# Altium project Robot Myjący podłogi.PrjPcb
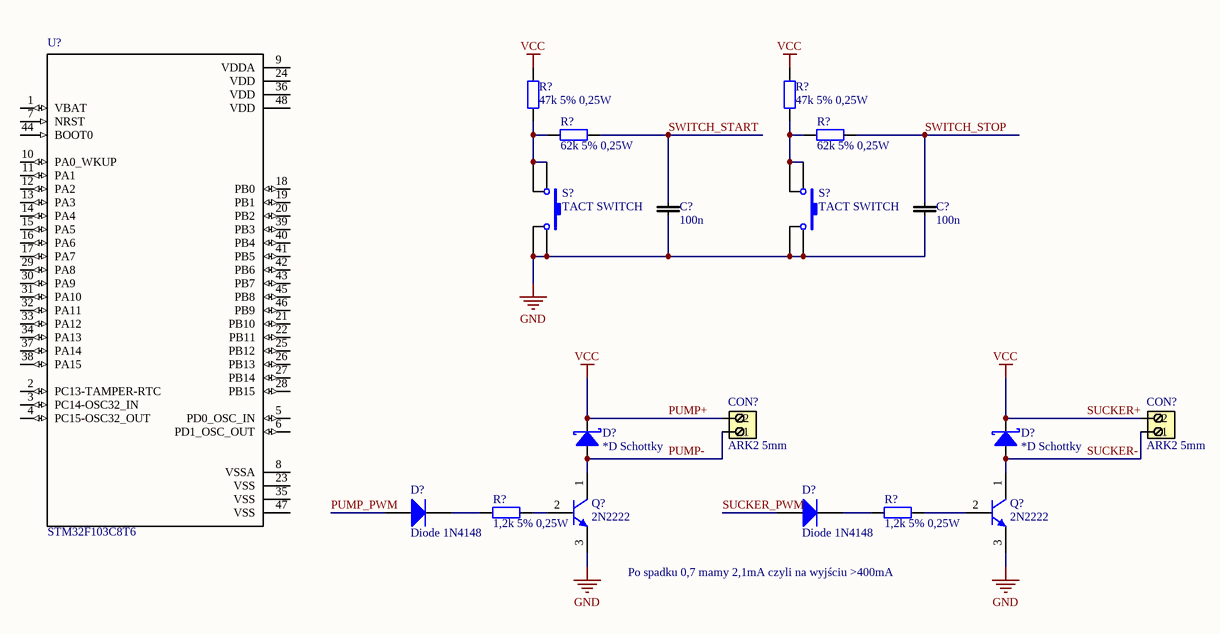
[diagram p0: Sheet1.SchDoc]
2 sheets, 106 parts. Net scope: global (net labels, ports and power ports of the same name join across sheets).
Board file: PCB1.PcbDoc
Sheets:
  Sheet1.SchDoc
  Sheet2.SchDoc

## Sheet Sheet1.SchDoc
size A4

### Parts
(Parts that share a designator on the sheet are numbered #1, #2 ... from top to bottom, then left to right.)
C?#1  100n  [C THT  FILM X2]
C?#2  100n  [C THT  FILM X2]
CON?#1  ARK2 5mm  [ARK5-2]
CON?#2  ARK2 5mm  [ARK5-2]
D?#1  *D Schottky  [SMA]
D?#2  *D Schottky  [SMA]
D?#3  Diode 1N4148  [DO-35]
D?#4  Diode 1N4148  [DO-35]
Q?#1  2N2222  [ONSC-TO-92-3-29-11]
Q?#2  2N2222  [ONSC-TO-92-3-29-11]
R?#1  47k 5% 0,25W  [RES-15mm_0.25W]
R?#2  47k 5% 0,25W  [RES-15mm_0.25W]
R?#3  62k 5% 0,25W  [RES-15mm_0.25W]
R?#4  62k 5% 0,25W  [RES-15mm_0.25W]
R?#5  1,2k 5% 0,25W  [RES-15mm_0.25W]
R?#6  1,2k 5% 0,25W  [RES-15mm_0.25W]
S?#1  TACT SWITCH  [DTS6]
S?#2  TACT SWITCH  [DTS6]
U?#1  STM32F103C8T6  [*QFP50P900X900X160-48N]

### Nets
GND: C?#1.1 C?#2.1 Q?#1.3(E) Q?#2.3(E) S?#1.3 S?#1.4 S?#2.3 S?#2.4
PUMP+: CON?#1.2 CON?#2.2 D?#1.2(K) D?#2.2(K) R?#1.2 R?#2.2  [also labelled SUCKER+, VCC]  [project net BUZZ+]
PUMP-: CON?#1.1 D?#1.1(A) Q?#1.1(C)
PUMP_PWM: D?#3.1(A)
SUCKER-: CON?#2.1 D?#2.1(A) Q?#2.1(C)
SUCKER_PWM: D?#4.1(A)
SWITCH_START: C?#1.2 R?#3.2
SWITCH_STOP: C?#2.2 R?#4.2
NetD?#3_2: D?#3.2(K) R?#5.1
NetD?#4_2: D?#4.2(K) R?#6.1
NetQ?#1_2: Q?#1.2(B) R?#5.2
NetQ?#2_2: Q?#2.2(B) R?#6.2
NetR?#1_1: R?#1.1 R?#3.1 S?#1.1 S?#1.2
NetR?#2_1: R?#2.1 R?#4.1 S?#2.1 S?#2.2

Not connected (* = marked no-connect by the designer): U?#1 1(VBAT) 2(PC13-TAMPER-RTC) 3(PC14-OSC32_IN) 4(PC15-OSC32_OUT) 5(PD0_OSC_IN) 6(PD1_OSC_OUT) 7(NRST) 8(VSSA) 9(VDDA) 10(PA0_WKUP) 11(PA1) 12(PA2) 13(PA3) 14(PA4) 15(PA5) 16(PA6) 17(PA7) 18(PB0) 19(PB1) 20(PB2) 21(PB10) 22(PB11) 23(VSS) 24(VDD) 25(PB12) 26(PB13) 27(PB14) 28(PB15) 29(PA8) 30(PA9) 31(PA10) 32(PA11) 33(PA12) 34(PA13) 35(VSS) 36(VDD) 37(PA14) 38(PA15) 39(PB3) 40(PB4) 41(PB5) 42(PB6) 43(PB7) 44(BOOT0) 45(PB8) 46(PB9) 47(VSS) 48(VDD)

### Notes on the sheet
- Po spadku 0,7 mamy 2,1mA czyli na wyjściu >400mA

### Library data of the parts
C?#1 C?#2 = *C THT: Film Capacitor; Publisher: Kamil Pawliczak; Value: 100n; HelpURL: C:\Altium\Biblioteki\elementy_bierne\doc\kondensator.txt
CON?#1 CON?#2 = ARK2 5mm: ARK2 CONNECTOR; Class: U; PN Piekarz: 00561; Preferred shop: Piekarz; PN Other: *; PN TME: EBBA-02-C-SS-BU; Publisher: NXT Labs; Type: CON
D?#1 D?#2 = *D Schottky: Schottky Diode; Publisher: Kamil Pawliczak
D?#3 D?#4 = Diode 1N4148: High Conductance Fast Diode; Published: 8-Jun-2000; LatestRevisionDate: 17-Jul-2002; LatestRevisionNote: Re-released for DXP Platform.; DatasheetVersion: 1997; PackageReference: DO-35; Publisher: Altium Limited; PackageDescription: Diode, Axial; Body 3.8 x 1.9 mm (LxDia. max), Lead Dia. 0.53 mm (max); Code_JEDEC: DO-204-AH; ComponentLink1Description: Manufacturer Link; ComponentLink1URL: http://www.fairchildsemi.com/; ComponentLink2Description: Datasheet; ComponentLink2URL: http://www.fairchildsemi.com/ds/1N%2F1N4148.pdf
Q?#1 Q?#2 = CMP-1048-01402-1: Amplifier Transistor, NPN Silicon, 3-Pin TO-92, Pb-Free, Bulk Box; PartNumber: P2N2222AG; Manufacturer: On Semiconductor; IC Continuous (A): 0.6; fT Min (MHz): 300; ComponentLink2Description: Datasheet; ComponentLink1Description: Manufacturer URL; ComponentLink2URL: http://www.onsemi.com/pub_link/Collateral/P2N2222A-D.PDF; ComponentLink3Description: Package Specification; RoHS: TRUE; ComponentLink1URL: http://www.onsemi.com/; Mounting Technology: Through Hole; PackageReference: TO-92-3-29-11_AM_SL; Polarity: NPN; Packing: Bulk Box; DatasheetVersion: Rev. 7; PackageDescription: 3-Pin Transistor Outline, Body 4.825 x 3.685 mm, Pitch 1.27 mm; PackageVersion: Rev. AM; ComponentLink3URL: http://www.onsemi.cn/pub_link/Collateral/2N6426-D.PDF
R?#1-R?#6 = 470 5% 0,25W H 15mm: Tht resistor; Value: 470; PN Piekarz: 03311; Preferred shop: P; Class: U; PD: 0,25W; Publisher: NXT Labs; Type: R; PN TME: CF1/4W-470R; PN Other: *; Tolerance: 5%
S?#1 S?#2 = TACT SWITCH: 6x6mm Switch; Publisher: Kamil Pawliczak; ComponentLink1Description: DTS6 - Dokumentacja; ComponentLink1URL: C:\Altium\Biblioteki\elementy_stykowe\doc\dts6.pdf
U?#1 = STM32F103C8T6: Mainstream Performance line, ARM Cortex-M3 MCU with 64 Kbytes Flash, 72 MHz CPU, motor control, USB and CAN; MF: STMicroelectronics; Price: None; MP: STM32F103C8T6; SnapEDA_Link: https://www.snapeda.com/parts/STM32F103C8T6/STMicroelectronics/view-part/?ref=snap; Package: LQFP-48 STMicroelectronics; Availability: Unavailable; Value: *

## Sheet Sheet2.SchDoc
size A2; Organization: Altium Limited; Address1: L3, 12a Rodborough Rd; Address2: Frenchs Forest; Address3: NSW; Address4: Australia 2086
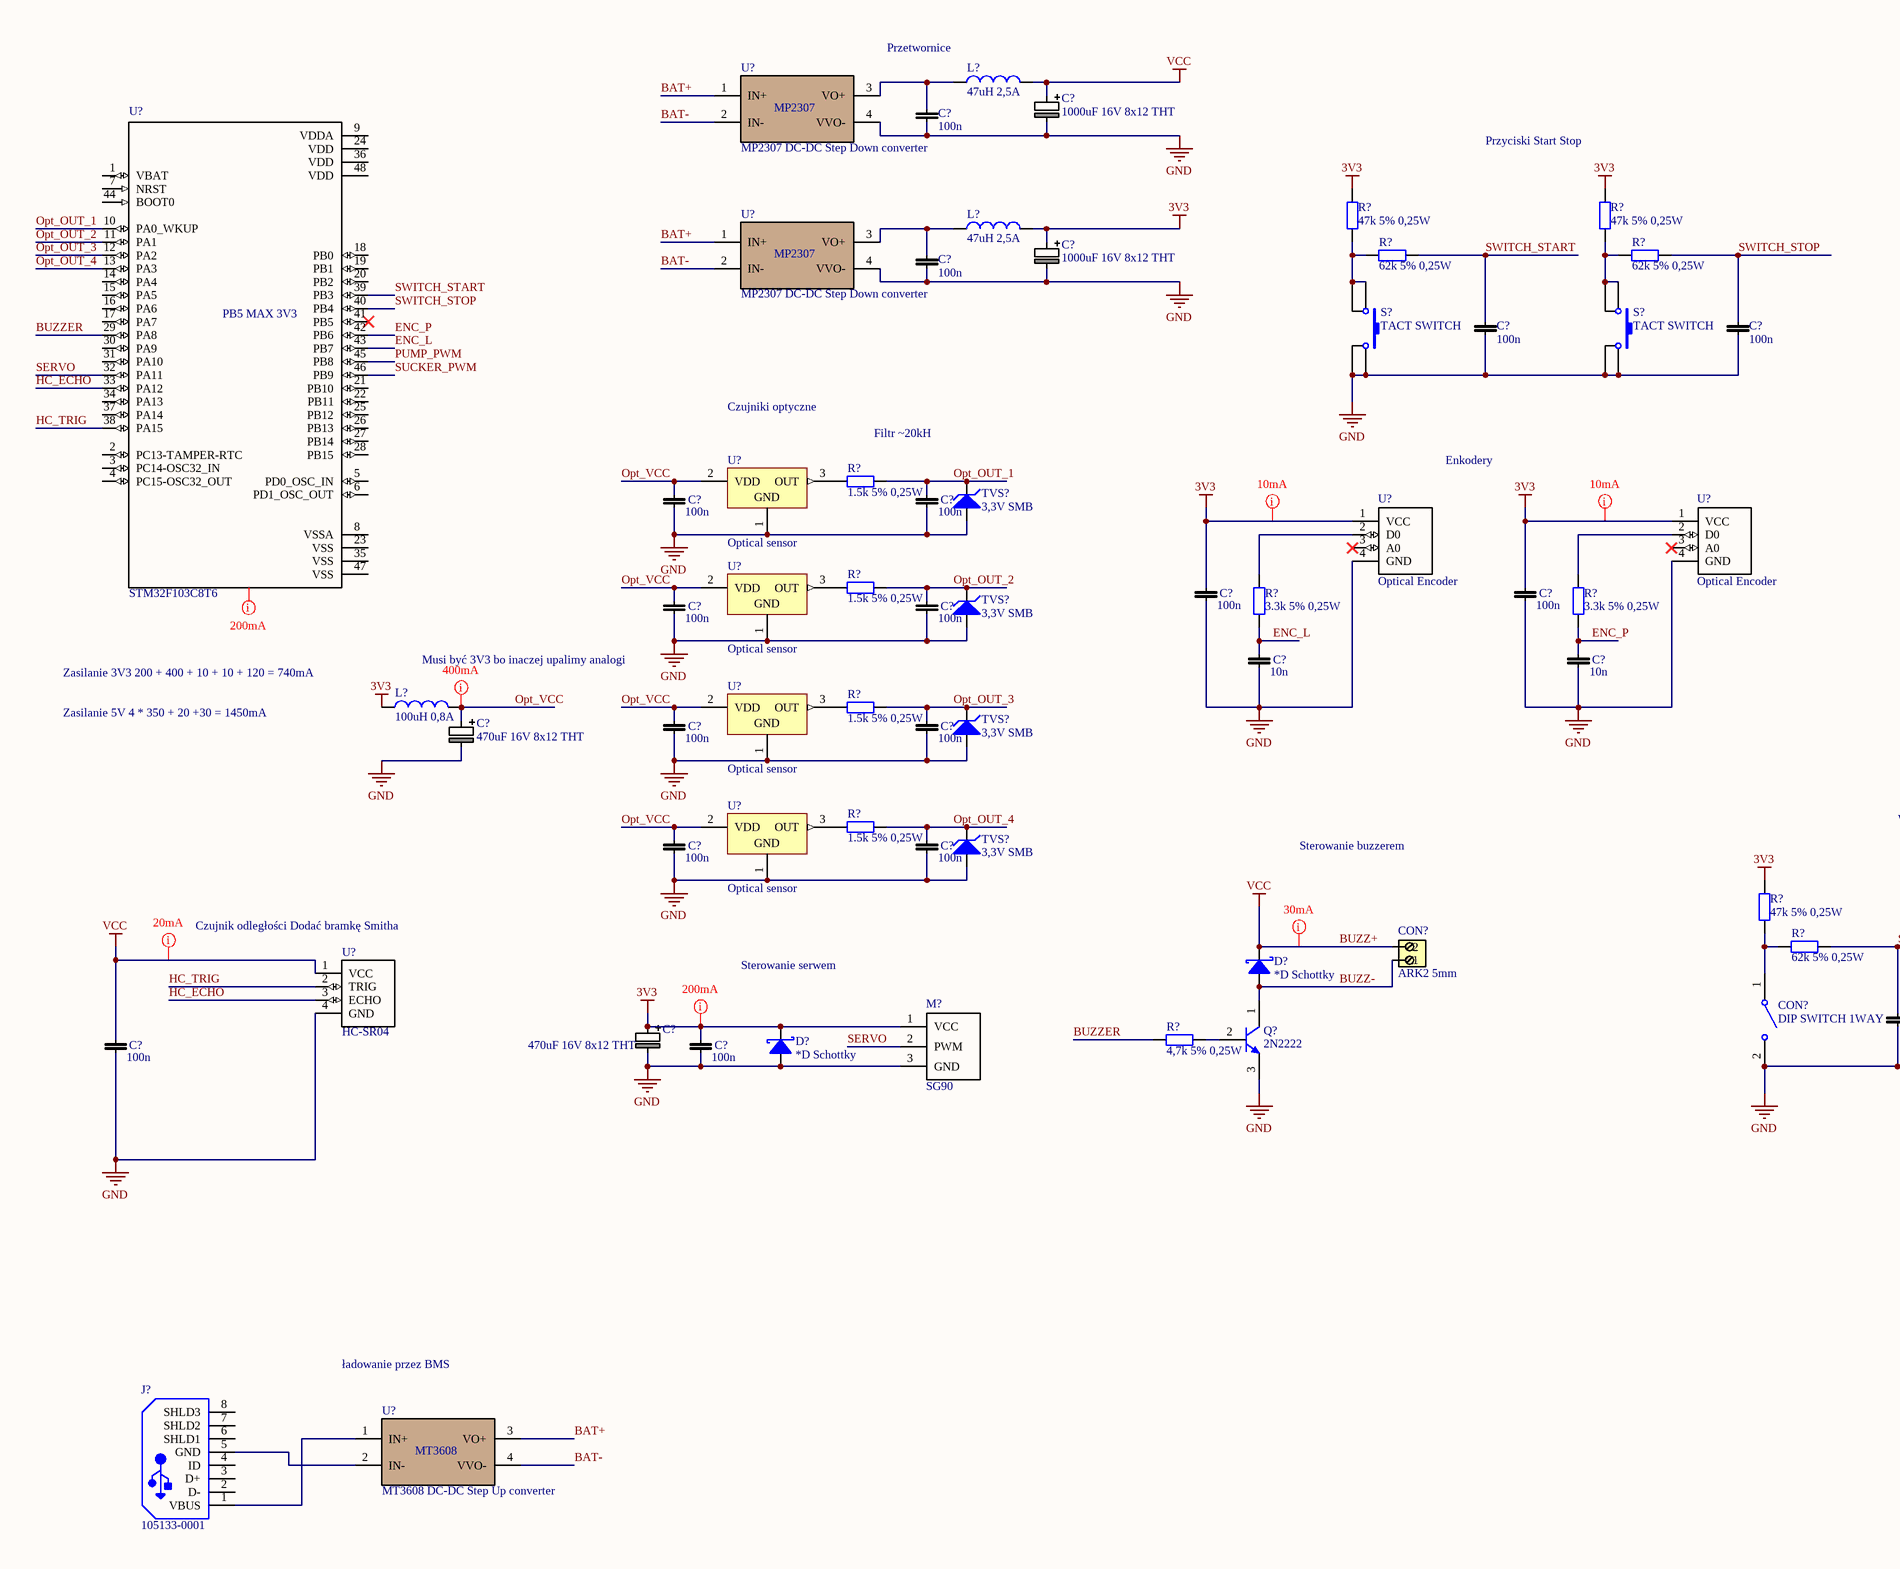
[diagram p1: Sheet2.SchDoc, left]
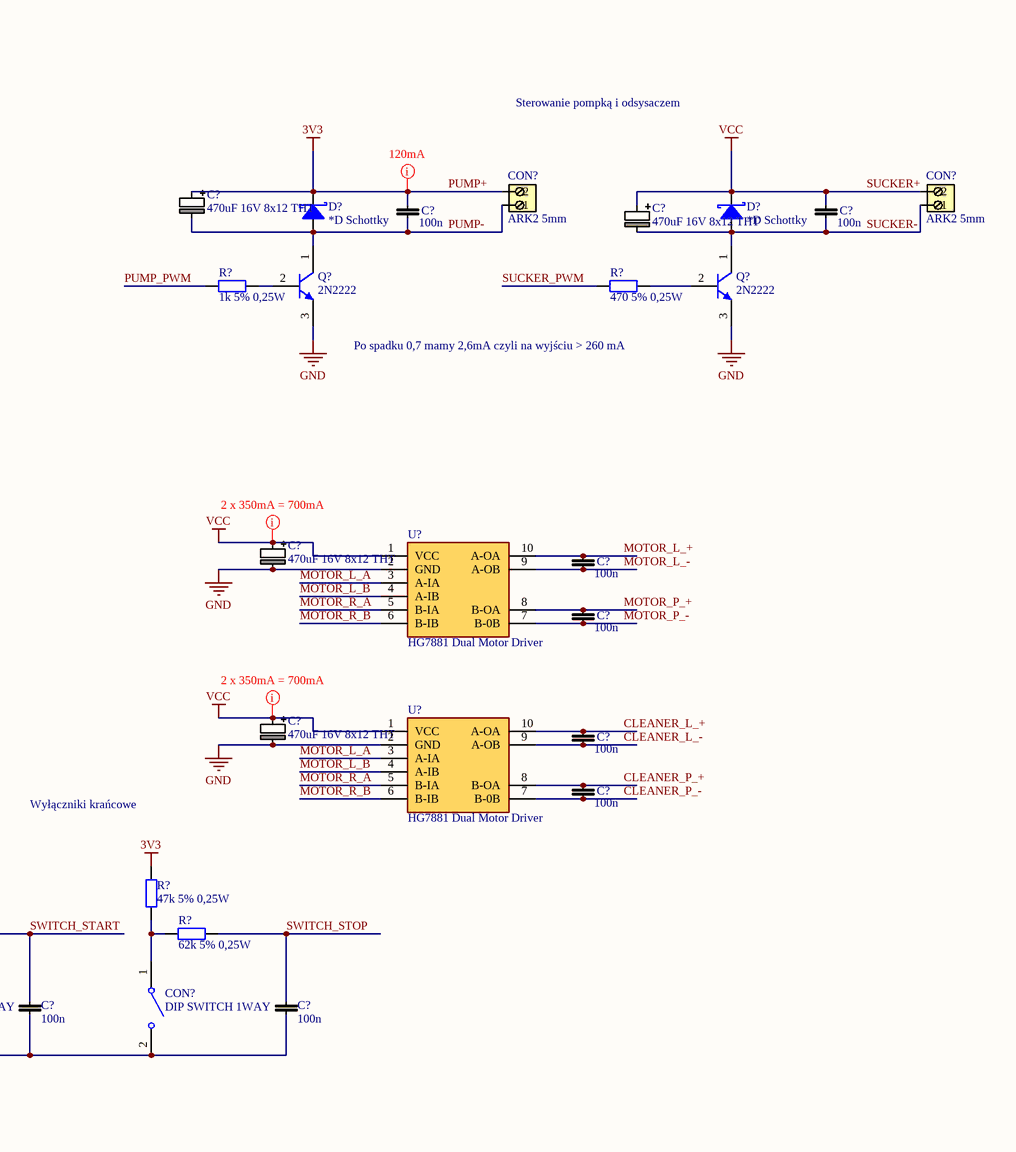
[diagram p2: Sheet2.SchDoc, right]

### Parts
(Parts that share a designator on the sheet are numbered #1, #2 ... from top to bottom, then left to right.)
C?#3  1000uF 16V 8x12 THT  [EL8x12]
C?#4  100n  [C THT  FILM X2]
C?#5  470uF 16V 8x12 THT  [EL8x12]
C?#6  100n  [C THT  FILM X2]
C?#7  470uF 16V 8x12 THT  [EL8x12]
C?#8  100n  [C THT  FILM X2]
C?#9  1000uF 16V 8x12 THT  [EL8x12]
C?#10  100n  [C THT  FILM X2]
C?#11  100n  [C THT  FILM X2]
C?#12  100n  [C THT  FILM X2]
C?#13  100n  [C THT  FILM X2]
C?#14  100n  [C THT  FILM X2]
C?#15  470uF 16V 8x12 THT  [EL8x12]
C?#16  100n  [C THT  FILM X2]
C?#17  100n  [C THT  FILM X2]
C?#18  100n  [C THT  FILM X2]
C?#19  100n  [C THT  FILM X2]
C?#20  100n  [C THT  FILM X2]
C?#21  100n  [C THT  FILM X2]
C?#22  10n  [C THT  FILM X2]
C?#23  10n  [C THT  FILM X2]
C?#24  470uF 16V 8x12 THT  [EL8x12]
C?#25  100n  [C THT  FILM X2]
C?#26  100n  [C THT  FILM X2]
C?#27  470uF 16V 8x12 THT  [EL8x12]
C?#28  100n  [C THT  FILM X2]
C?#29  100n  [C THT  FILM X2]
C?#30  100n  [C THT  FILM X2]
C?#31  100n  [C THT  FILM X2]
C?#32  100n  [C THT  FILM X2]
C?#33  100n  [C THT  FILM X2]
C?#34  470uF 16V 8x12 THT  [EL8x12]
C?#35  100n  [C THT  FILM X2]
C?#36  100n  [C THT  FILM X2]
CON?#3  ARK2 5mm  [ARK5-2]
CON?#4  ARK2 5mm  [ARK5-2]
CON?#5  ARK2 5mm  [ARK5-2]
CON?#6  DIP SWITCH 1WAY  [DIP_SWITCH_1P_L]
CON?#7  DIP SWITCH 1WAY  [DIP_SWITCH_1P_L]
D?#5  *D Schottky  [SMA]
D?#6  *D Schottky  [SMA]
D?#7  *D Schottky  [SMA]
D?#8  *D Schottky  [SMA]
J?  105133-0001  [MOLX-105133-0001_V]
L?#1  47uH 2,5A  [MSS1278 SERIES]
L?#2  47uH 2,5A  [MSS1278 SERIES]
L?#3  100uH 0,8A  [MSS1278 SERIES]
M?  SG90
Q?#3  2N2222  [ONSC-TO-92-3-29-11]
Q?#4  2N2222  [ONSC-TO-92-3-29-11]
Q?#5  2N2222  [ONSC-TO-92-3-29-11]
R?#7  47k 5% 0,25W  [RES-15mm_0.25W]
R?#8  47k 5% 0,25W  [RES-15mm_0.25W]
R?#9  62k 5% 0,25W  [RES-15mm_0.25W]
R?#10  62k 5% 0,25W  [RES-15mm_0.25W]
R?#11  1k 5% 0,25W  [RES-15mm_0.25W]
R?#12  470 5% 0,25W  [RES-15mm_0.25W]
R?#13  1.5k 5% 0,25W  [RES-15mm_0.25W]
R?#14  1.5k 5% 0,25W  [RES-15mm_0.25W]
R?#15  3.3k 5% 0,25W  [RES-15mm_0.25W]
R?#16  3.3k 5% 0,25W  [RES-15mm_0.25W]
R?#17  1.5k 5% 0,25W  [RES-15mm_0.25W]
R?#18  1.5k 5% 0,25W  [RES-15mm_0.25W]
R?#19  47k 5% 0,25W  [RES-15mm_0.25W]
R?#20  47k 5% 0,25W  [RES-15mm_0.25W]
R?#21  62k 5% 0,25W  [RES-15mm_0.25W]
R?#22  62k 5% 0,25W  [RES-15mm_0.25W]
R?#23  4,7k 5% 0,25W  [RES-15mm_0.25W]
S?#3  TACT SWITCH  [DTS6]
S?#4  TACT SWITCH  [DTS6]
TVS?#1  3,3V SMB  [SMB]
TVS?#2  3,3V SMB  [SMB]
TVS?#3  3,3V SMB  [SMB]
TVS?#4  3,3V SMB  [SMB]
U?#2  MP2307 DC-DC Step Down converter  [DC_DC_SINGLE]
U?#3  MP2307 DC-DC Step Down converter  [DC_DC_SINGLE]
U?#4  STM32F103C8T6  [*QFP50P900X900X160-48N]
U?#5  Optical sensor  [AMS-S-3-4600X2600_V]
U?#6  Optical Encoder
U?#7  Optical Encoder
U?#8  Optical sensor  [AMS-S-3-4600X2600_V]
U?#9  HG7881 Dual Motor Driver
U?#10  Optical sensor  [AMS-S-3-4600X2600_V]
U?#11  HG7881 Dual Motor Driver
U?#12  Optical sensor  [AMS-S-3-4600X2600_V]
U?#13  HC-SR04  [*XCVR_HC-SR04]
U?#14  MT3608 DC-DC Step Up converter  [DC_DC_SINGLE]

### Nets
BUZZ+: C?#3.2(+) C?#5.2(+) C?#6.2 C?#7.2(+) C?#8.2 C?#9.2(+) C?#15.2(+) C?#17.2 C?#18.2 C?#27.2(+) C?#34.2(+) C?#35.2 C?#36.2 CON?#3.2 CON?#4.2 CON?#5.2 D?#5.2(K) D?#6.2(K) D?#7.2(K) D?#8.2(K) L?#1.2 L?#2.2 L?#3.1 M?.1(VCC) R?#7.2 R?#8.2 R?#19.2 R?#20.2 U?#6.1(VCC) U?#7.1(VCC) U?#9.1(VCC) U?#11.1(VCC) U?#13.1(VCC)  [also labelled 3V3, PUMP+, SUCKER+, VCC]
GND: C?#3.1(-) C?#4.1 C?#9.1(-) C?#10.1 C?#11.1 C?#12.1 C?#13.1 C?#14.1 C?#15.1(-) C?#17.1 C?#18.1 C?#19.1 C?#20.1 C?#22.1 C?#23.1 C?#24.1(-) C?#25.1 C?#26.1 C?#27.1(-) C?#30.1 C?#31.1 C?#32.1 C?#33.1 C?#34.1(-) C?#35.1 C?#36.1 CON?#6.2 CON?#7.2 D?#8.1(A) M?.3(GND) Q?#3.3(E) Q?#4.3(E) Q?#5.3(E) S?#3.3 S?#3.4 S?#4.3 S?#4.4 TVS?#1.1(A) TVS?#2.1(A) TVS?#3.1(A) TVS?#4.1(A) U?#2.4(VVO-) U?#3.4(VVO-) U?#5.1(GND) U?#6.4(GND) U?#7.4(GND) U?#8.1(GND) U?#9.2(GND) U?#10.1(GND) U?#11.2(GND) U?#12.1(GND) U?#13.4(GND)
BAT+: U?#2.1(IN+) U?#3.1(IN+) U?#14.3(VO+)
BAT-: U?#2.2(IN-) U?#3.2(IN-) U?#14.4(VVO-)
BUZZ-: CON?#5.1 D?#7.1(A) Q?#5.1(C)
BUZZER: R?#23.1 U?#4.29(PA8)
CLEANER_L_+: C?#28.2 U?#11.10(A-OA)
CLEANER_L_-: C?#28.1 U?#11.9(A-OB)
CLEANER_P_+: C?#29.2 U?#11.8(B-OA)
CLEANER_P_-: C?#29.1 U?#11.7(B-0B)
ENC_L: C?#22.2 R?#15.1 U?#4.43(PB7)
ENC_P: C?#23.2 R?#16.1 U?#4.42(PB6)
HC_ECHO: U?#4.33(PA12) U?#13.3(ECHO)
HC_TRIG: U?#4.38(PA15) U?#13.2(TRIG)
MOTOR_L_+: C?#16.2 U?#9.10(A-OA)
MOTOR_L_-: C?#16.1 U?#9.9(A-OB)
MOTOR_L_A: U?#9.3(A-IA) U?#11.3(A-IA)
MOTOR_L_B: U?#9.4(A-IB) U?#11.4(A-IB)
MOTOR_P_+: C?#21.2 U?#9.8(B-OA)
MOTOR_P_-: C?#21.1 U?#9.7(B-0B)
MOTOR_R_A: U?#9.5(B-IA) U?#11.5(B-IA)
MOTOR_R_B: U?#9.6(B-IB) U?#11.6(B-IB)
Opt_OUT_1: C?#14.2 R?#13.2 TVS?#1.2(K) U?#4.10(PA0_WKUP)
Opt_OUT_2: C?#20.2 R?#14.2 TVS?#2.2(K) U?#4.11(PA1)
Opt_OUT_3: C?#26.2 R?#17.2 TVS?#3.2(K) U?#4.12(PA2)
Opt_OUT_4: C?#31.2 R?#18.2 TVS?#4.2(K) U?#4.13(PA3)
Opt_VCC: C?#13.2 C?#19.2 C?#24.2(+) C?#25.2 C?#30.2 L?#3.2 U?#5.2(VDD) U?#8.2(VDD) U?#10.2(VDD) U?#12.2(VDD)
PUMP-: C?#5.1(-) C?#6.1 CON?#3.1 D?#5.1(A) Q?#3.1(C)
PUMP_PWM: R?#11.1 U?#4.45(PB8)
SERVO: M?.2(PWM) U?#4.32(PA11)
SUCKER-: C?#7.1(-) C?#8.1 CON?#4.1 D?#6.1(A) Q?#4.1(C)
SUCKER_PWM: R?#12.1 U?#4.46(PB9)
SWITCH_START: C?#11.2 C?#32.2 R?#9.2 R?#21.2 U?#4.39(PB3)
SWITCH_STOP: C?#12.2 C?#33.2 R?#10.2 R?#22.2 U?#4.40(PB4)
NetC?#4_2: C?#4.2 L?#1.1 U?#2.3(VO+)
NetC?#10_2: C?#10.2 L?#2.1 U?#3.3(VO+)
NetCON?#6_1: CON?#6.1 R?#19.1 R?#21.1
NetCON?#7_1: CON?#7.1 R?#20.1 R?#22.1
NetJ?_1: J?.1(VBUS) U?#14.1(IN+)
NetJ?_5: J?.5(GND) U?#14.2(IN-)
NetQ?#3_2: Q?#3.2(B) R?#11.2
NetQ?#4_2: Q?#4.2(B) R?#12.2
NetQ?#5_2: Q?#5.2(B) R?#23.2
NetR?#7_1: R?#7.1 R?#9.1 S?#3.1 S?#3.2
NetR?#8_1: R?#8.1 R?#10.1 S?#4.1 S?#4.2
NetR?#13_1: R?#13.1 U?#5.3(OUT)
NetR?#14_1: R?#14.1 U?#8.3(OUT)
NetR?#15_2: R?#15.2 U?#6.2(D0)
NetR?#16_2: R?#16.2 U?#7.2(D0)
NetR?#17_1: R?#17.1 U?#10.3(OUT)
NetR?#18_1: R?#18.1 U?#12.3(OUT)

Not connected (* = marked no-connect by the designer): J? 2(D-) 3(D+) 4(ID) 6(SHLD1) 7(SHLD2) 8(SHLD3); U?#4 1(VBAT) 2(PC13-TAMPER-RTC) 3(PC14-OSC32_IN) 4(PC15-OSC32_OUT) 5(PD0_OSC_IN) 6(PD1_OSC_OUT) 7(NRST) 8(VSSA) 9(VDDA) 14(PA4) 15(PA5) 16(PA6) 17(PA7) 18(PB0) 19(PB1) 20(PB2) 21(PB10) 22(PB11) 23(VSS) 24(VDD) 25(PB12) 26(PB13) 27(PB14) 28(PB15) 30(PA9) 31(PA10) 34(PA13) 35(VSS) 36(VDD) 37(PA14) 41(PB5)* 44(BOOT0) 47(VSS) 48(VDD); U?#6 3(A0)*; U?#7 3(A0)*

### Layout directives
mark named 2 x 350mA = 700mA: BUZZ+
mark named 20mA: BUZZ+
mark named 30mA: BUZZ+
mark named 120mA: BUZZ+
mark named 200mA: (no net found under the mark), BUZZ+
mark named 400mA: Opt_VCC
mark named 10mA: BUZZ+

### Notes on the sheet
- (near L?#1) Przetwornice
- Przyciski Start Stop
- Sterowanie pompką i odsysaczem
- (near U?#4) PB5 MAX 3V3
- Po spadku 0,7 mamy 2,6mA czyli na wyjściu > 260 mA
- Czujniki optyczne
- Filtr ~20kH
- Enkodery
- Zasilanie 3V3 200 + 400 + 10 + 10 + 120 = 740mA
- Musi być 3V3 bo inaczej upalimy analogi
- Zasilanie 5V 4 * 350 + 20 +30 = 1450mA
- Wyłączniki krańcowe
- Sterowanie buzzerem
- (near U?#13) Czujnik odległości Dodać bramkę Smitha
- Sterowanie serwem
- ładowanie przez BMS
- Title
- Size:
- Date:
- File:
- A2
- Number:
- Time:
- Revision:
- Sheet
- of

### Library data of the parts
C?#3 C?#9 = 470uF 16V 8x12 THT El: electrolytic capacitor; Value: 470uF; Class: U; Type: C; PN Piekarz: 35886; Preferred shop: P; Tolerance: 10%; Publisher: NXT Labs; Voltage: 16V; PN TME: RD1C477M0811MBB; PN Other: *; Dielectric: electrolytic
C?#4 C?#6 C?#8 C?#10-C?#14 C?#16-C?#21 C?#25 C?#26 C?#28-C?#33 C?#35 C?#36 = *C THT: Film Capacitor; Publisher: Kamil Pawliczak; Value: 100n; HelpURL: C:\Altium\Biblioteki\elementy_bierne\doc\kondensator.txt
C?#5 C?#7 C?#15 C?#24 C?#27 C?#34 = 470uF 16V 8x12 THT El: electrolytic capacitor; Class: U; Type: C; PN Piekarz: 35886; Preferred shop: P; Tolerance: 10%; Publisher: NXT Labs; Value: 470uF; Voltage: 16V; PN TME: RD1C477M0811MBB; PN Other: *; Dielectric: electrolytic
C?#22 C?#23 = *C THT: Film Capacitor; Value: 100n; Publisher: Kamil Pawliczak; HelpURL: C:\Altium\Biblioteki\elementy_bierne\doc\kondensator.txt
CON?#3-CON?#5 = ARK2 5mm: as CON?#1 on sheet Sheet1; PN Other: *; PN TME: EBBA-02-C-SS-BU; Publisher: NXT Labs; Type: CON
CON?#6 CON?#7 = DIP SWITCH 1WAY: Class: U; PN Piekarz: 22494; Preferred shop: Piekarz; Footprint: DIP_Switch_1P_L; PN Other: *; PN TME: A6S-1104-H; Publisher: NXT Labs; Type: CON
D?#5-D?#8 = *D Schottky: Schottky Diode; Publisher: Kamil Pawliczak
J? = CMP-2000-05829-1: Micro-USB B Receptacle, Vertical, -30 to 85 degC, 5-Pin SMD, RoHS, Tape and Reel; Manufacturer: Molex; Package Version: Rev. C, 11/2015; Voltage Rating: 30VAC; Connector Type: MicroUSBTypeBReceptacle; Current Rating: 1.8A; Number of Ports: 1; Voltage - Max: 30V; Mounting Style: SMD/SMT; Packaging: Reel; Product: MicroUSBTypeBConnectors; Contact Plating: Gold; Flammability Rating: UL94V-0; Package Description: 5-Pin Surface Mount Device, Pitch 0.65 mm; Package Reference: 105133-0001; Contact Material: CopperAlloy; Mounting Angle: Vertical; RoHS: Details; Manufacturer URL: http://www.molex.com/; Factory Pack Quantity: 6000; PartNumber: 105133-0001; Standard: USB; Brand: Molex; Series: 105133; Product Category: USBConnectors; Termination Style: SolderTail; Gender: Receptacle; Package URL: http://www.molex.com/pdm_docs/sd/1051330001_sd.pdf; Datasheet Version: 03/2016; Color: Black; Datasheet URL: http://www.molex.com/webdocs/datasheets/pdf/en-us/1051330001_IO_CONNECTORS.pdf; Mounting Technology: SurfaceMount
L?#1 L?#2 = 47uH 2,5A DE 1207 POWER: SMD POWER INDUCTOR; Tolerance: 20%; PN Piekarz: 20048; Class: S; Preferred shop: Piekarz; Current: 2,5A; Type: L; Resistance: 0,1; Footprint: MSS1278 series; Publisher: NXT Labs; PN TME: DE1207-47; PN Other: *; Inductance: 47uH; Case: DE 1207
L?#3 = 100uH 1,7A DE 1207 POWER: SMD POWER INDUCTOR; Tolerance: 20%; PN Piekarz: 18200; Class: S; Preferred shop: Piekarz; Current: 1,7A; Type: L; Resistance: 0,22; Footprint: MSS1278 series; Publisher: NXT Labs; PN TME: DE1207-100; PN Other: *; Inductance: 100uH; Case: DE 1207
M? = SG90 servo: SG90 micro servo; Class: S; Footprint: *; PN Other: *; PN Piekarz: *; PN TME: *; Preferred shop: *; Type: U; Publisher: NXT Labs
Q?#3-Q?#5 = CMP-1048-01402-1: as Q?#1 on sheet Sheet1; ComponentLink2Description: Datasheet; ComponentLink1Description: Manufacturer URL; ComponentLink2URL: http://www.onsemi.com/pub_link/Collateral/P2N2222A-D.PDF; ComponentLink3Description: Package Specification; RoHS: TRUE; ComponentLink1URL: http://www.onsemi.com/; Mounting Technology: Through Hole; PackageReference: TO-92-3-29-11_AM_SL; Polarity: NPN; Packing: Bulk Box; DatasheetVersion: Rev. 7; PackageDescription: 3-Pin Transistor Outline, Body 4.825 x 3.685 mm, Pitch 1.27 mm; PackageVersion: Rev. AM; ComponentLink3URL: http://www.onsemi.cn/pub_link/Collateral/2N6426-D.PDF
R?#7-R?#23 = 470 5% 0,25W H 15mm: as R?#1 on sheet Sheet1; Publisher: NXT Labs; Type: R; PN TME: CF1/4W-470R; PN Other: *; Tolerance: 5%
S?#3 S?#4 = TACT SWITCH: 6x6mm Switch; Publisher: Kamil Pawliczak; ComponentLink1Description: DTS6 - Dokumentacja; ComponentLink1URL: C:\Altium\Biblioteki\elementy_stykowe\doc\dts6.pdf
TVS?#1-TVS?#4 = TVS 3,3V l SMB: Smd TVS; Class: U; PN Piekarz: 22690; Preferred shop: P; Voltage: 3,3V; PD: 600W; Tolerance: 5%; Publisher: NXT Labs; PN Other: *; PN TME: *; Type: TVS
U?#2 U?#3 = MP2307: MT3608 DC-DC Step Down converter 1.8A 340kHz 1-17V; Publisher: Kamil Pawliczak
U?#4 = STM32F103C8T6: as U?#1 on sheet Sheet1; Price: None; MP: STM32F103C8T6; SnapEDA_Link: https://www.snapeda.com/parts/STM32F103C8T6/STMicroelectronics/view-part/?ref=snap; Package: LQFP-48 STMicroelectronics; Availability: Unavailable; Value: *
U?#5 U?#8 U?#10 U?#12 = CMP-0550-00065-2: IR Light-to-Voltage Converter - Fast Response and Low-Noise, S-3, Pb-Free; Manufacturer: AMS; PartNumber: TSL262R-LF; Fast Response Time: TRUE; Responsivity Wavelength (nm): 940; Operating Voltage (V): 2.7-5.5; ComponentLink1Description: Manufacturer URL; Low Noise: TRUE; ComponentLink2URL: http://www.ams.com/eng/content/download/250430/976493/142386; PackageDescription: 3-Pin Plastic Single In Line Side Looker Package, 4.6 x 2.6 mm Body, 2 mm Pitch; PackageReference: S-3; Mounting Technology: Through Hole; PackageVersion: TAOS052J, 09/2008; DatasheetVersion: TAOS049E; ComponentLink1URL: www.ams.com; ComponentLink2Description: Datasheet
U?#6 U?#7 = Optical Encoder: Encoder; Class: S; Preferred shop: P; Footprint: *; PN Other: *; PN Piekarz: *; PN TME: *; Type: U; Publisher: NXT Labs
U?#9 U?#11 = HG7881 Dual Motor Driver: Dual Motor Driver; Class: S; Footprint: *; PN Other: *; PN Piekarz: *; PN TME: *; Preferred shop: *; Type: U; Publisher: NXT Labs
U?#13 = HC-SR04: HC-SR04 Ultrasonic Sensor For Arduino And Raspberry Pi HC-SR04 Ultrasonic Sensor For Arduino And Raspberry Pi; MF: Adafruit Industries; SnapEDA_Link: https://www.snapeda.com/parts/HC-SR04/Adafruit%20Industries%20LLC/view-part/?ref=snap; Price: None; Availability: Unavailable; Package: None; MP: HC-SR04; Value: *
U?#14 = MT3608: MT3608 DC-DC Step Up converter 2A 1.2MHz; Publisher: Kamil Pawliczak

## Nets that join several sheets
BUZZ+: Sheet1 (6 pins), Sheet2 (33 pins)
GND: Sheet1 (8 pins), Sheet2 (52 pins)
PUMP-: Sheet1 (CON?#1.1 D?#1.1 Q?#1.1), Sheet2 (5 pins)
PUMP_PWM: Sheet1 (D?#3.1), Sheet2 (R?#11.1 U?#4.45)
SUCKER-: Sheet1 (CON?#2.1 D?#2.1 Q?#2.1), Sheet2 (5 pins)
SUCKER_PWM: Sheet1 (D?#4.1), Sheet2 (R?#12.1 U?#4.46)
SWITCH_START: Sheet1 (C?#1.2 R?#3.2), Sheet2 (5 pins)
SWITCH_STOP: Sheet1 (C?#2.2 R?#4.2), Sheet2 (5 pins)